# Altium schematic sheet sound.SCHDOC: LiveDesign Evaluation - Video Games
size B; Organization: Altium Limited; Address1: L3, 12a Rodborough Rd; Address2: Frenchs Forest; Address3: NSW; Address4: Australia 2086; DocumentNumber: 11; SheetNumber: 11; SheetTotal: 13
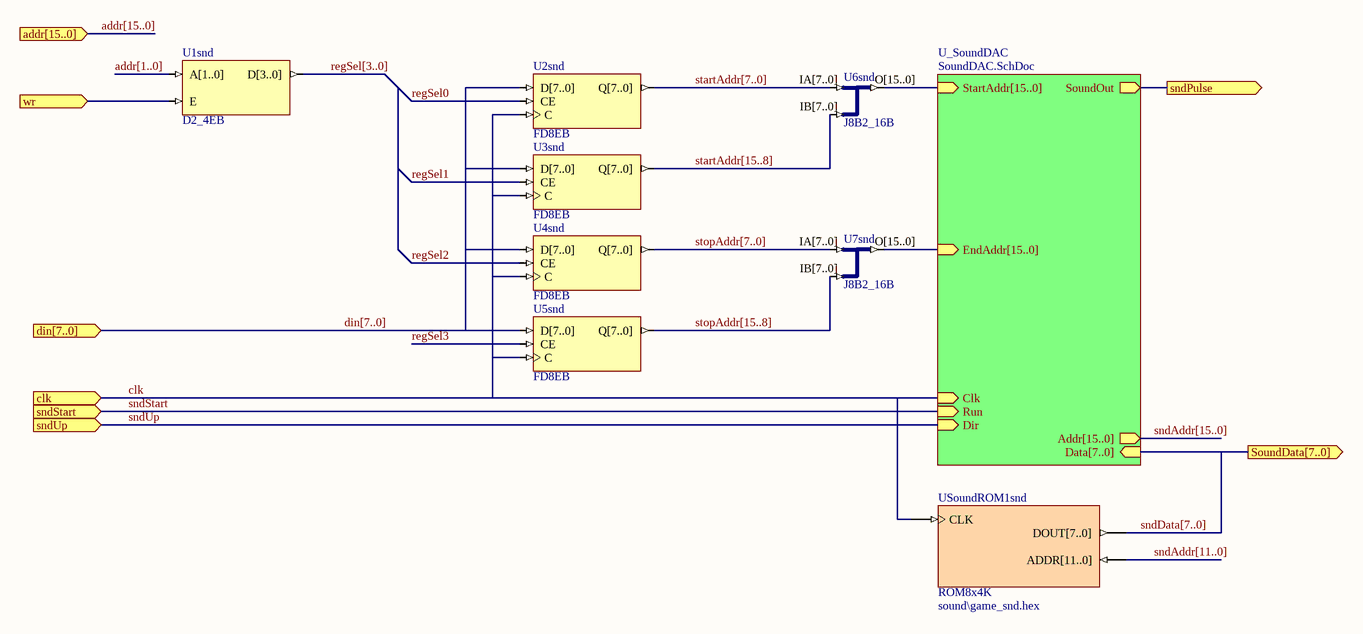
[diagram p0: sound.SCHDOC]

## Parts
U1snd  D2_4EB
U2snd  FD8EB
U3snd  FD8EB
U4snd  FD8EB
U5snd  FD8EB
U6snd  J8B2_16B
U7snd  J8B2_16B
USoundROM1snd  ROM8x4K  Memory_ContentFile: sound\game_snd.hex

## Sub-sheets
U_SoundDAC = SoundDAC.SchDoc: Clk (in), Data[7..0] (in), Addr[15..0] (out), EndAddr[15..0] (in), StartAddr[15..0] (in), SoundOut (out), Run (in), Dir (in)

## Ports
addr[15..0] (in), clk (in), din[7..0] (in), sndPulse (out), sndStart (in), sndUp (in), SoundData[7..0] (out), wr (in)

## Nets
addr[1..0]: U1snd.A[1..0]
clk: U2snd.C U3snd.C U4snd.C U5snd.C USoundROM1snd.CLK ; port clk, sheet U_SoundDAC/Clk
din[7..0]: U2snd.D[7..0] U3snd.D[7..0] U4snd.D[7..0] U5snd.D[7..0] ; port din[7..0]
regSel0: U2snd.CE
regSel1: U3snd.CE
regSel2: U4snd.CE
regSel3: U5snd.CE
regSel[3..0]: U1snd.D[3..0]
sndAddr[11..0]: USoundROM1snd.ADDR[11..0]
sndData[7..0]: USoundROM1snd.DOUT[7..0] ; port SoundData[7..0], sheet U_SoundDAC/Data[7..0]
sndPulse: port sndPulse, sheet U_SoundDAC/SoundOut
sndStart: port sndStart, sheet U_SoundDAC/Run
sndUp: port sndUp, sheet U_SoundDAC/Dir
startAddr[7..0]: U2snd.Q[7..0] U6snd.IA[7..0]
startAddr[15..8]: U3snd.Q[7..0] U6snd.IB[7..0]
stopAddr[7..0]: U4snd.Q[7..0] U7snd.IA[7..0]
stopAddr[15..8]: U5snd.Q[7..0] U7snd.IB[7..0]
wr: U1snd.E ; port wr
NetU6snd_O[15..0]: U6snd.O[15..0] ; sheet U_SoundDAC/StartAddr[15..0]
NetU7snd_O[15..0]: U7snd.O[15..0] ; sheet U_SoundDAC/EndAddr[15..0]

## Buses and harness runs
bus addr[1..0]
bus addr[15..0] = port addr[15..0]
bus din[7..0] = port din[7..0]
bus regSel[3..0]
bus sndAddr[11..0]
bus sndAddr[15..0] = sheet U_SoundDAC/Addr[15..0]
bus sndData[7..0] = port SoundData[7..0] = sheet U_SoundDAC/Data[7..0]
bus startAddr[7..0]
bus startAddr[15..8]
bus stopAddr[7..0]
bus stopAddr[15..8]

## Notes on the sheet
- Title
- Size:
- Date:
- B
- Number:
- Time:
- Revision:
- Sheet
- of
- File:

## Library data of the parts
U1snd = D2_4EB: Binary 2- to 4-Bit Decoder with Enable, Bus Version; ArchiveName: GENERIC; Published: 7-Nov-2003; Publisher: Altium Limited; Core Revision: 1.00.00
U2snd U3snd U4snd U5snd = FD8EB: 8-Bit D Flip-Flop with Clock Enable, Bus Version; ArchiveName: GENERIC; Published: 9-30-2003; Publisher: Altium Limited; Core Revision: 1.00.00
U6snd U7snd = J8B2_16B: 2 x 8-Bit input bus to 1 x 16-bit output bus; ArchiveName: GENERIC; Published: 18-Dec-2003; Publisher: Altium Limited; Core Revision: 1.00.00
USoundROM1snd = ROM8x4K: Single Port Read Only Memory 4096 x 8; Memory_Depth: 4096; Memory_Type: ROM_SinglePortBlock; Memory_Width: 8; Memory_ClockEdge: Rising; Nexus_Core: Memory_Program; Published: 26/09/2003; Publisher: Altium Hobart Technology Center